# Altium schematic sheet LVRegulation.SchDoc
size A; SheetNumber: 8; SheetTotal: 12; SPICEModelCacheTGRHLAKJ: <root> / <DocumentId>TGRHLAKJ</DocumentId> / </root>
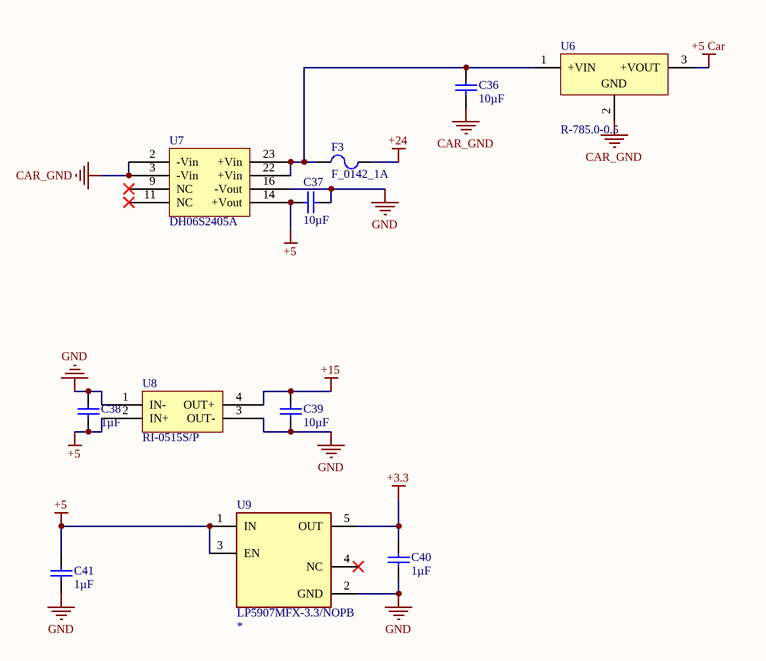
[diagram p0: LVRegulation.SchDoc]

## Parts
C36  value 10µF  [1210_Capacitor]  (hidden comment: Cap Cerem 10uF 10% 50V)
C37  value 10µF  [1210_Capacitor]  (hidden comment: Cap Cerem 10uF 10% 50V)
C38  value 1µF  [0805_Capacitor]  (hidden comment: CAP 0805 1uF 50V)
C39  value 10µF  [1210_Capacitor]  (hidden comment: Cap Cerem 10uF 10% 50V)
C40  value 1µF  [0805_Capacitor]  (hidden comment: CAP 0805 1uF 50V)
C41  value 1µF  [0805_Capacitor]  (hidden comment: CAP 0805 1uF 50V)
F3  F_0142_1A  [0154_FUSE_HOLDER]
U6  R-785.0-0.5  [REPO-R-78XX-3_V]
U7  DH06S2405A  [DH06S2405A-Footprint-1]
U8  RI-0515S/P  [ROE-2405S-Footprint-1]
U9  LP5907MFX-3.3/NOPB  [FP-DBV0005A-MFG]

## Nets
+3.3: C40.2 U9.5(OUT)
+5: C37.1 C38.1 C41.2 U7.14(+Vout) U8.2(IN+) U9.1(IN) U9.3(EN)
+5 Car: U6.3(+VOUT)
+15: C39.2 U8.4(OUT+)
+24: F3.2
CAR_GND: C36.1 U6.2(GND) U7.2(-Vin) U7.3(-Vin)
GND: C37.2 C38.2 C39.1 C40.1 C41.1 U7.16(-Vout) U8.1(IN-) U8.3(OUT-) U9.2(GND)
NetC36_2: C36.2 F3.1 U6.1(+VIN) U7.22(+Vin) U7.23(+Vin)

Not connected (* = marked no-connect by the designer): U7 9(NC)* 11(NC)*; U9 4(NC)*

## Library data of the parts
C36 C37 C39 = CMP-001-00101-3: Capacitor Type: Ceramic; Mounting Technology: SM; Tolerance: 10%; Voltage Rating: 50V; Case/Package: 1210
C38 C40 C41 = CMP-001-00098-1: Tolerance: 10%; Capacitor Type: Ceramic; Voltage Rating: 50V; Case/Package: 0805; Mounting Technology: SMT
F3 = CMP-105-000000-1: SVP Creator: Spencer Berglund; Current: 1A; Design Item ID: F_0142_1A; Source: Common.SchLib
U6 = CMP-019-00059-1: DC-DC Regulated Power Supply Module, 1 Output, 2.5W, Hybrid; Output Current: 500mA; Min Supply Voltage: 6.5V; Output Voltage: 5V; Max Supply Voltage: 32V; RoHS Compliant: Yes; Pins: 3; Mounting Technology: TH; Max Operating Temperature: 71°C; Min Operating Temperature: -40°C; Case/Package: SIP-3
U7 = CMP-019-00061-4: DC/DC converter 18...75 VDC 5 VDC, DJ06S4805A, Delta-Electronics; Output Voltage: 5V; Max Supply Voltage: 36V; Min Supply Voltage: 18V; Output Current: 1.2A; RoHS Compliant: Yes; Min Operating Temperature: -40°C; Max Operating Temperature: 85°C; Mounting Technology: TH; Case/Package: DIP; Pins: 8
U8 = CMP-019-00064-1: DC-DC Unregulated Power Supply Module, 1 Output, 2W, Hybrid; Min Supply Voltage: 4.5V; Max Supply Voltage: 5V; Output Voltage: 15V; Output Current: 133mA; Max Operating Temperature: 85°C; Pins: 4; RoHS Compliant: Yes; Min Operating Temperature: -40°C; Mounting Technology: TH; Case/Package: 4-SIP
U9 = CMP-171-000000-7: Fixed Positive LDO Regulator, 3.3V, 0.25V Dropout, PDSO5; Output Voltage1-Max: 3.366V; Number of Functions: 1; Input Voltage Absolute-Max: 6V; Dropout Voltage1-Nom: 120mV; MP: LP5907MFX-3.0/NOPB; Min Input Voltage: 2.2V; MF: Texas Instruments; Regulator Type: FIXED POSITIVE SINGLE OUTPUT LDO REGULATOR; Output Voltage1-Min: 3.234V; Package Equivalence Code: TSOP5/6,.11,37; Package Body Material: Plastic; Dropout Voltage1-Max: 250mV; Qualification Status: Not Qualified; Max Input Voltage: 5.5V; Voltage Tolerance-Max: 2%; Output Current1-Max: 250mA; Packaging: Tape and Reel; Reach SVHC Compliant: Yes; RoHS Compliant: Yes; Moisture Sensitivity Level: 1; Technology: CMOS; Component Type: Standard; SnapEDA_Link: https://www.snapeda.com/parts/LP5907MFX-3.0/NOPB/Texas%20Instruments/view-part/379728/?ref=snap; Source: LP5907MFX-3.0_NOPB.SchLib; Mouser-Purchase-URL: https://snapeda.com/shop?store=Mouser&id=379728; Value: *; Terminal Form: Gull Wing; Number of Outputs: 1; Number of Pins: 5; JESD-30 Code: R-PDSO-G5; Height - Seated (Max): 1.45mm; Availability: Unavailable; JESD-609 Code: e3; Arrow_Electronics-Purchase-URL: https://snapeda.com/shop?store=Arrow+Electronics&id=379728; Width: 1.6mm; Package Shape: Rectangular; Texas_Instruments-Purchase-URL: https://snapeda.com/shop?store=Texas+Instruments&id=379728; Peak Reflow Temperature (Cel): 260°C; Package Code: LSSOP; Pin Count: 5; Price: None; Package Style: SMALL OUTLINE, LOW PROFILE, SHRINK PITCHMeter; Terminal Finish: Tin; Output Voltage1-Nom: 3.3V; Adjustability: FIXED; Terminal Pitch: 0.95mm; Terminal Position: DUAL; DigiKey-Purchase-URL: https://snapeda.com/shop?store=DigiKey&id=379728; Operating Temperature, TJ-Min: -40°C; Surface Mount: Yes; Package: SOT-23-5 Texas Instruments; Length: 2.9mm; Operating Temperature, TJ-Max: 125°C; Design Item ID: LP5907MFX-3.0/NOPB